# EasyEDA schematic SCH_混频器.json
TITLE: Sheet_1; REV: 1.0; Date: 2024-05-10; Sheet: 1/1; Drawn By: l_galois; Company: Your Company
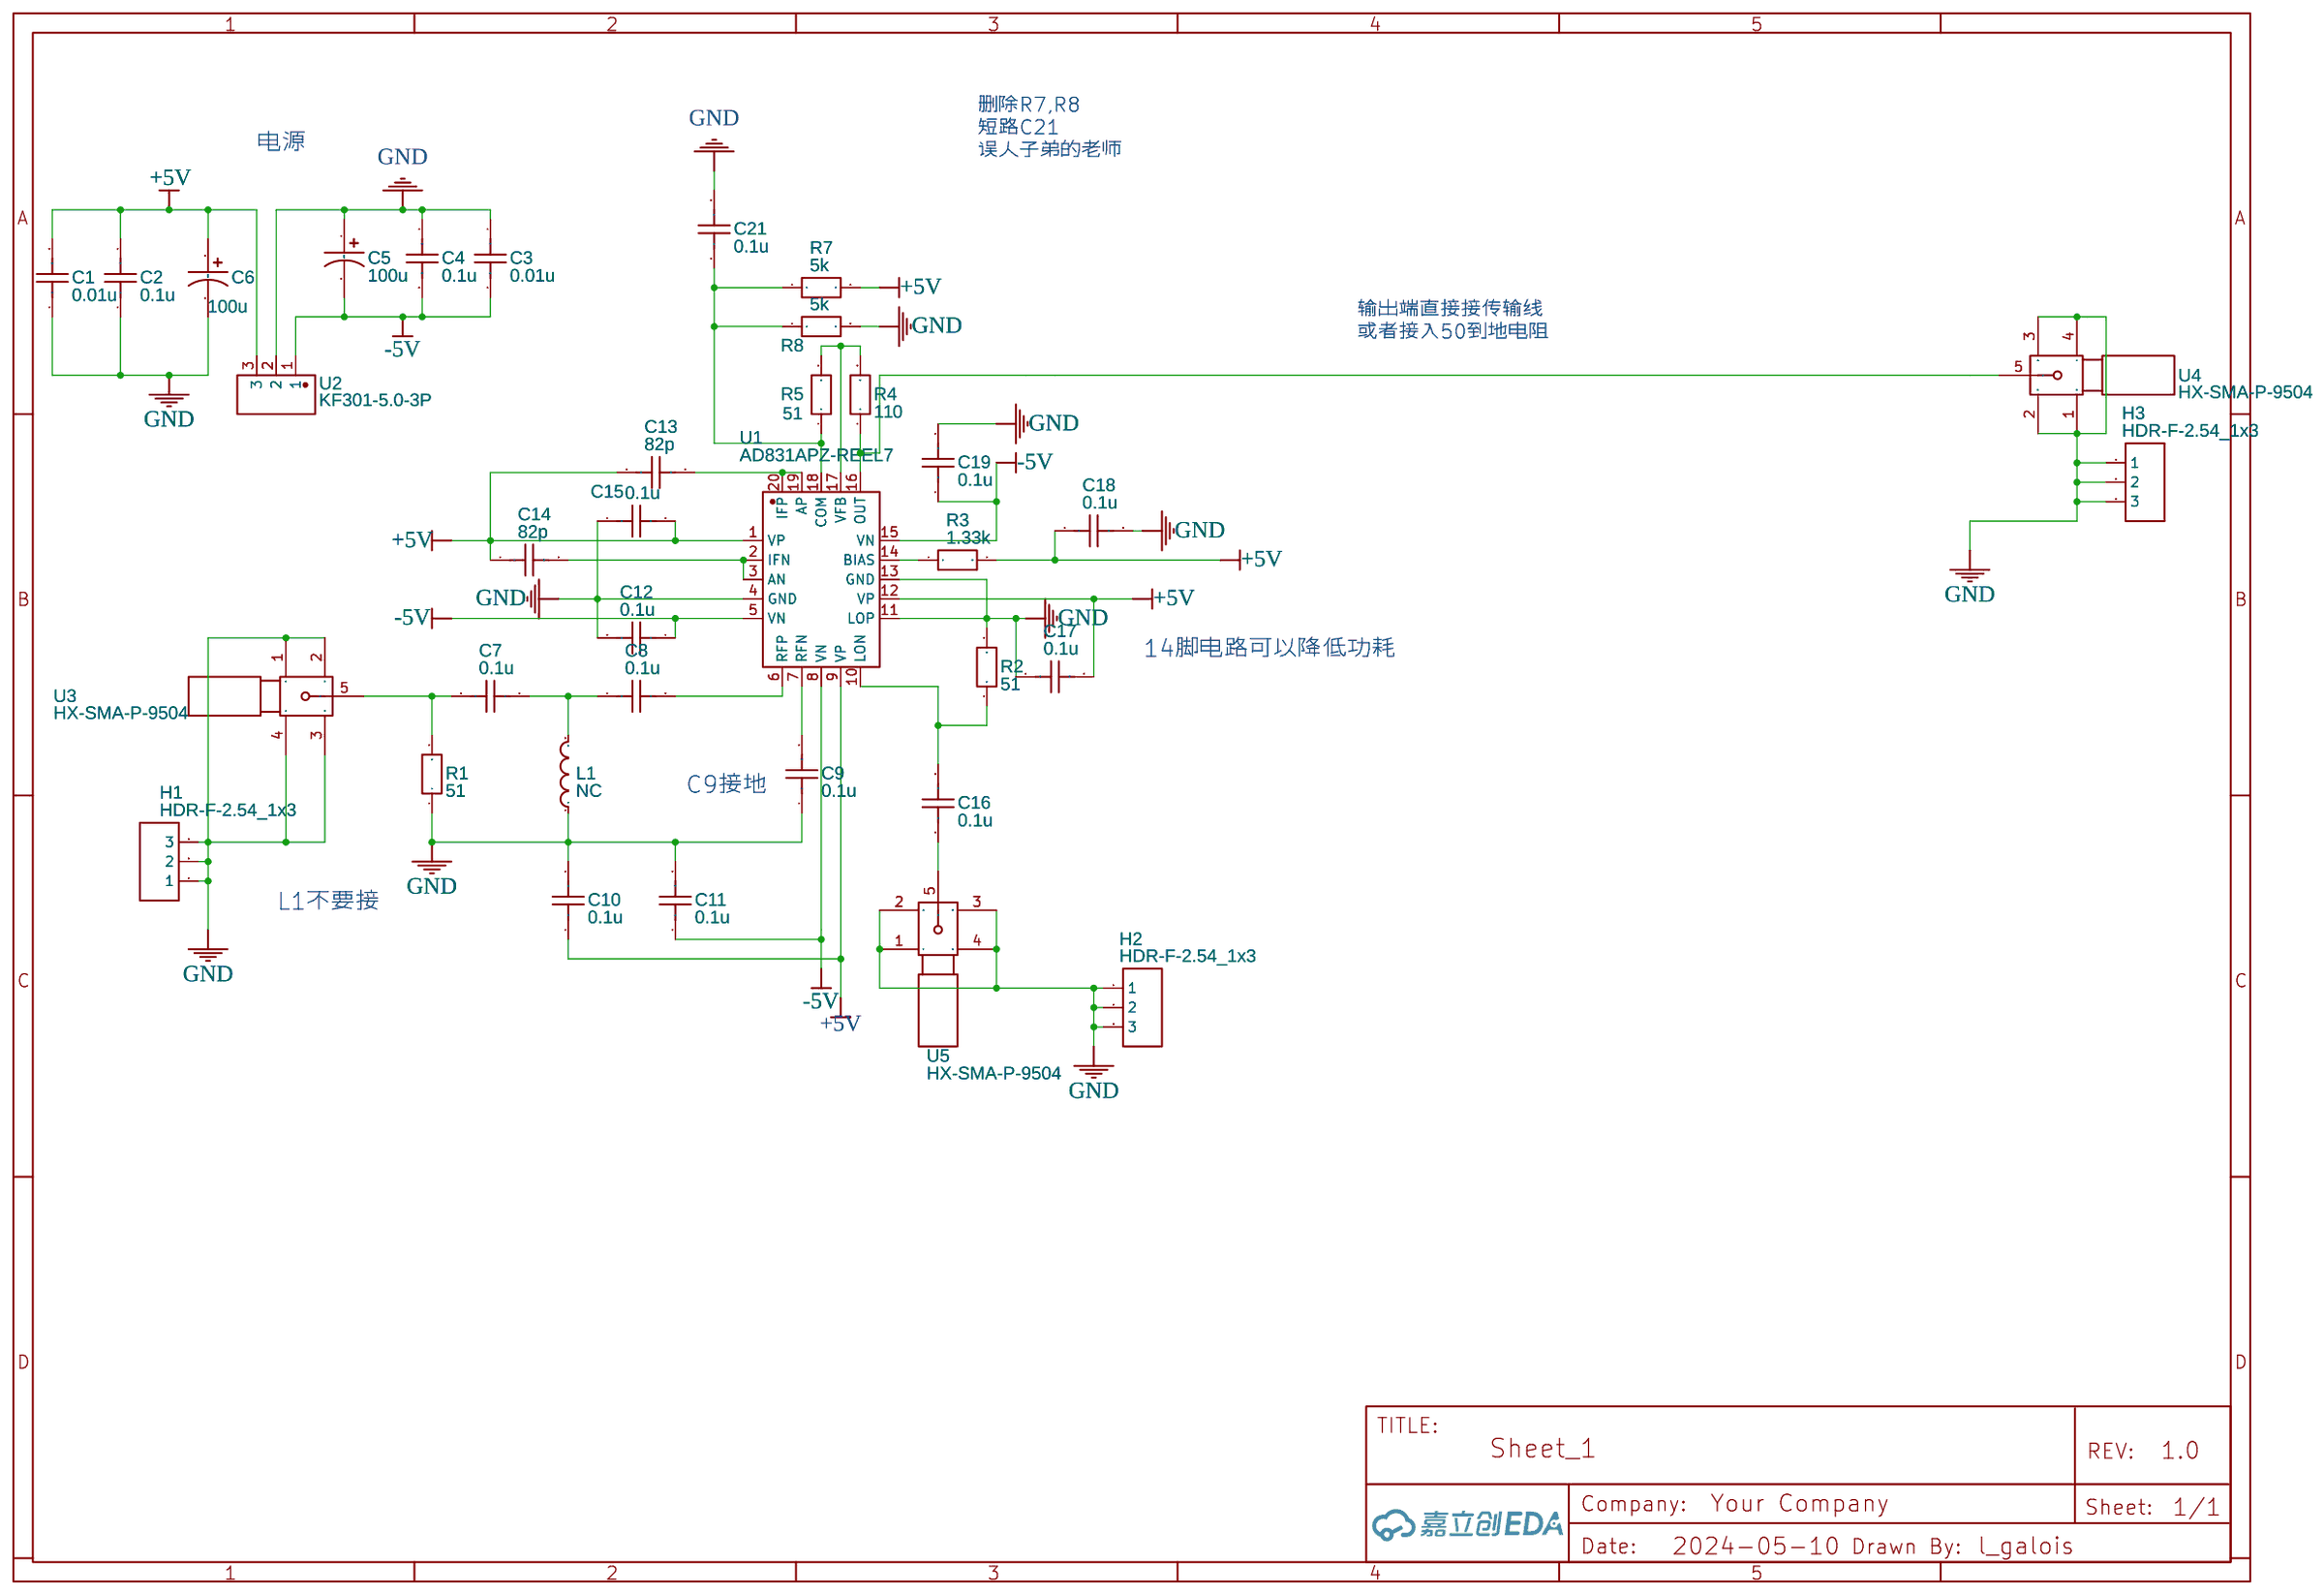
[diagram p0: schematic sheet]

## Parts
C1  0.01u  [C0805]
C2  0.1u  [C0805]
C3  0.01u  [C0805]
C4  0.1u  [C0805]
C5  100u  [CAP-SMD_BD5.0-L5.3-W5.3-LS6.1-FD-1]
C6  100u  [CAP-SMD_BD5.0-L5.3-W5.3-LS6.1-FD-1]
C7  0.1u  [C0805]
C8  0.1u  [C0805]
C9  0.1u  [C0805]
C10  0.1u  [C0805]
C11  0.1u  [C0805]
C12  0.1u  [C0805]
C13  82p  [C0805]
C14  82p  [C0805]
C15  0.1u  [C0805]
C16  0.1u  [C0805]
C17  0.1u  [C0805]
C18  0.1u  [C0805]
C19  0.1u  [C0805]
C21  0.1u  [C0805]
H1  HDR-F-2.54_1x3  [HDR-F-2.54_1X3]
H2  HDR-F-2.54_1x3  [HDR-F-2.54_1X3]
H3  HDR-F-2.54_1x3  [HDR-F-2.54_1X3]
L1  NC  [L0805]
R1  51  [R0805]
R2  51  [R0805]
R3  1.33k  [R0805]
R4  110  [R0805]
R5  51  [R0805]
R7  5k  [R0805]
R8  5k  [R0805]
U1  AD831APZ-REEL7  [PLCC-20_L9.0-W9.0-P1.27-LS10.0-T]
U2  KF301-5.0-3P  [CONN-TH_3P-P5.00_KF301-5.0-3P]
U3  HX-SMA-P-9504  [RF-SMA-SMD_HX-SMA-P-9631]
U4  HX-SMA-P-9504  [RF-SMA-SMD_HX-SMA-P-9631]
U5  HX-SMA-P-9504  [RF-SMA-SMD_HX-SMA-P-9631]

## Library data of the parts
C1-C4 C7-C19 C21 = C_0805_US: Contributor: LCEDA_Lib
C5 = C_Tan_SMD_A_US: Contributor: LCEDA_Lib
C6 = CE_SMD_D8.0×H10.5_US: Contributor: LCEDA_Lib
H1-H3 = HDR-F-2.54_1x3: Supplier Part: C146690; Supplier: LCSC; Contributor: LCEDA_Lib
L1 = L0805_US: Contributor: LCEDA_Lib
R1-R5 R7 R8 = R_0805_EU: Contributor: LCEDA_Lib
U1 = AD831APZ-REEL7: Contributor: LCSC; Supplier: LCSC; Supplier Part: C652694; Manufacturer: ADI(亚德诺); JLCPCB Part Class: Extended Part; link: https://so.szlcsc.com/global.html?k=C652694&ref=editor
U2 = KF301-5.0-3P: Contributor: LCSC; Supplier: LCSC; Supplier Part: C474882; Manufacturer: KEFA(科发); JLCPCB Part Class: Extended Part; link: https://so.szlcsc.com/global.html?k=C474882&ref=editor
U3-U5 = HX-SMA-P-9504: Contributor: lcsc; Supplier: LCSC; Supplier Part: C5124055; Manufacturer: 环协; JLCPCB Part Class: Extended Part; link: https://so.szlcsc.com/global.html?k=C5124055&ref=editor

## Nets
+5V: C1.2 C2.2 C6.1 C10.1 C13.1 C14.1 C15.2 C17.2 C18.1 R3.2 R7.2 U1.1(VP) U1.9(VP) U1.12(VP) U2.3
-5V: C3.2 C4.2 C5.2 C11.1 C12.1 C19.1 U1.5(VN) U1.8(VN) U1.15(VN) U2.1
GND: C1.1 C2.1 C3.1 C4.1 C5.1 C6.2 C9.1 C10.2 C11.2 C12.2 C15.1 C17.1 C18.2 C19.2 C21.2 H1.1 H1.2 H1.3 H2.1 H2.2 H2.3 H3.1 H3.2 H3.3 L1.1 R1.1 R2.2 R8.2 U1.4(GND) U1.11(LOP) U1.13(GND) U2.2 U3.1 U3.2 U3.3 U3.4 U4.1 U4.2 U4.3 U4.4 U5.1 U5.2 U5.3 U5.4
Net-(C7-1): C7.1 R1.2 U3.5
Net-(C7-2): C7.2 C8.1 L1.2
Net-(C8-2): C8.2 U1.6(RFP)
Net-(C9-2): C9.2 U1.7(RFN)
Net-(C13-2): C13.2 U1.19(AP) U1.20(IFP)
Net-(C14-2): C14.2 U1.2(IFN) U1.3(AN)
Net-(C16-1): C16.1 U5.5
Net-(C16-2): C16.2 R2.1 U1.10(LON)
Net-(C21-1): C21.1 R5.1 R7.1 R8.1 U1.18(COM)
Net-(R3-1): R3.1 U1.14(BIAS)
Net-(R4-1): R4.1 U1.16(OUT) U4.5
Net-(R4-2): R4.2 R5.2 U1.17(VFB)

## Notes on the sheet
- 删除R7,R8
  短路C21
  误人子弟的老师
- 电源
- 输出端直接接传输线
  或者接入50到地电阻
- 14脚电路可以降低功耗
- C9接地
- L1不要接
